# EasyEDA Pro project ProPrj_PCB_PCB_PCB_PCB_STM32F103C8T6(gift)_2023-09-09_2023-10-22_2024-01-15_2025-05-12.epro, board PCB5
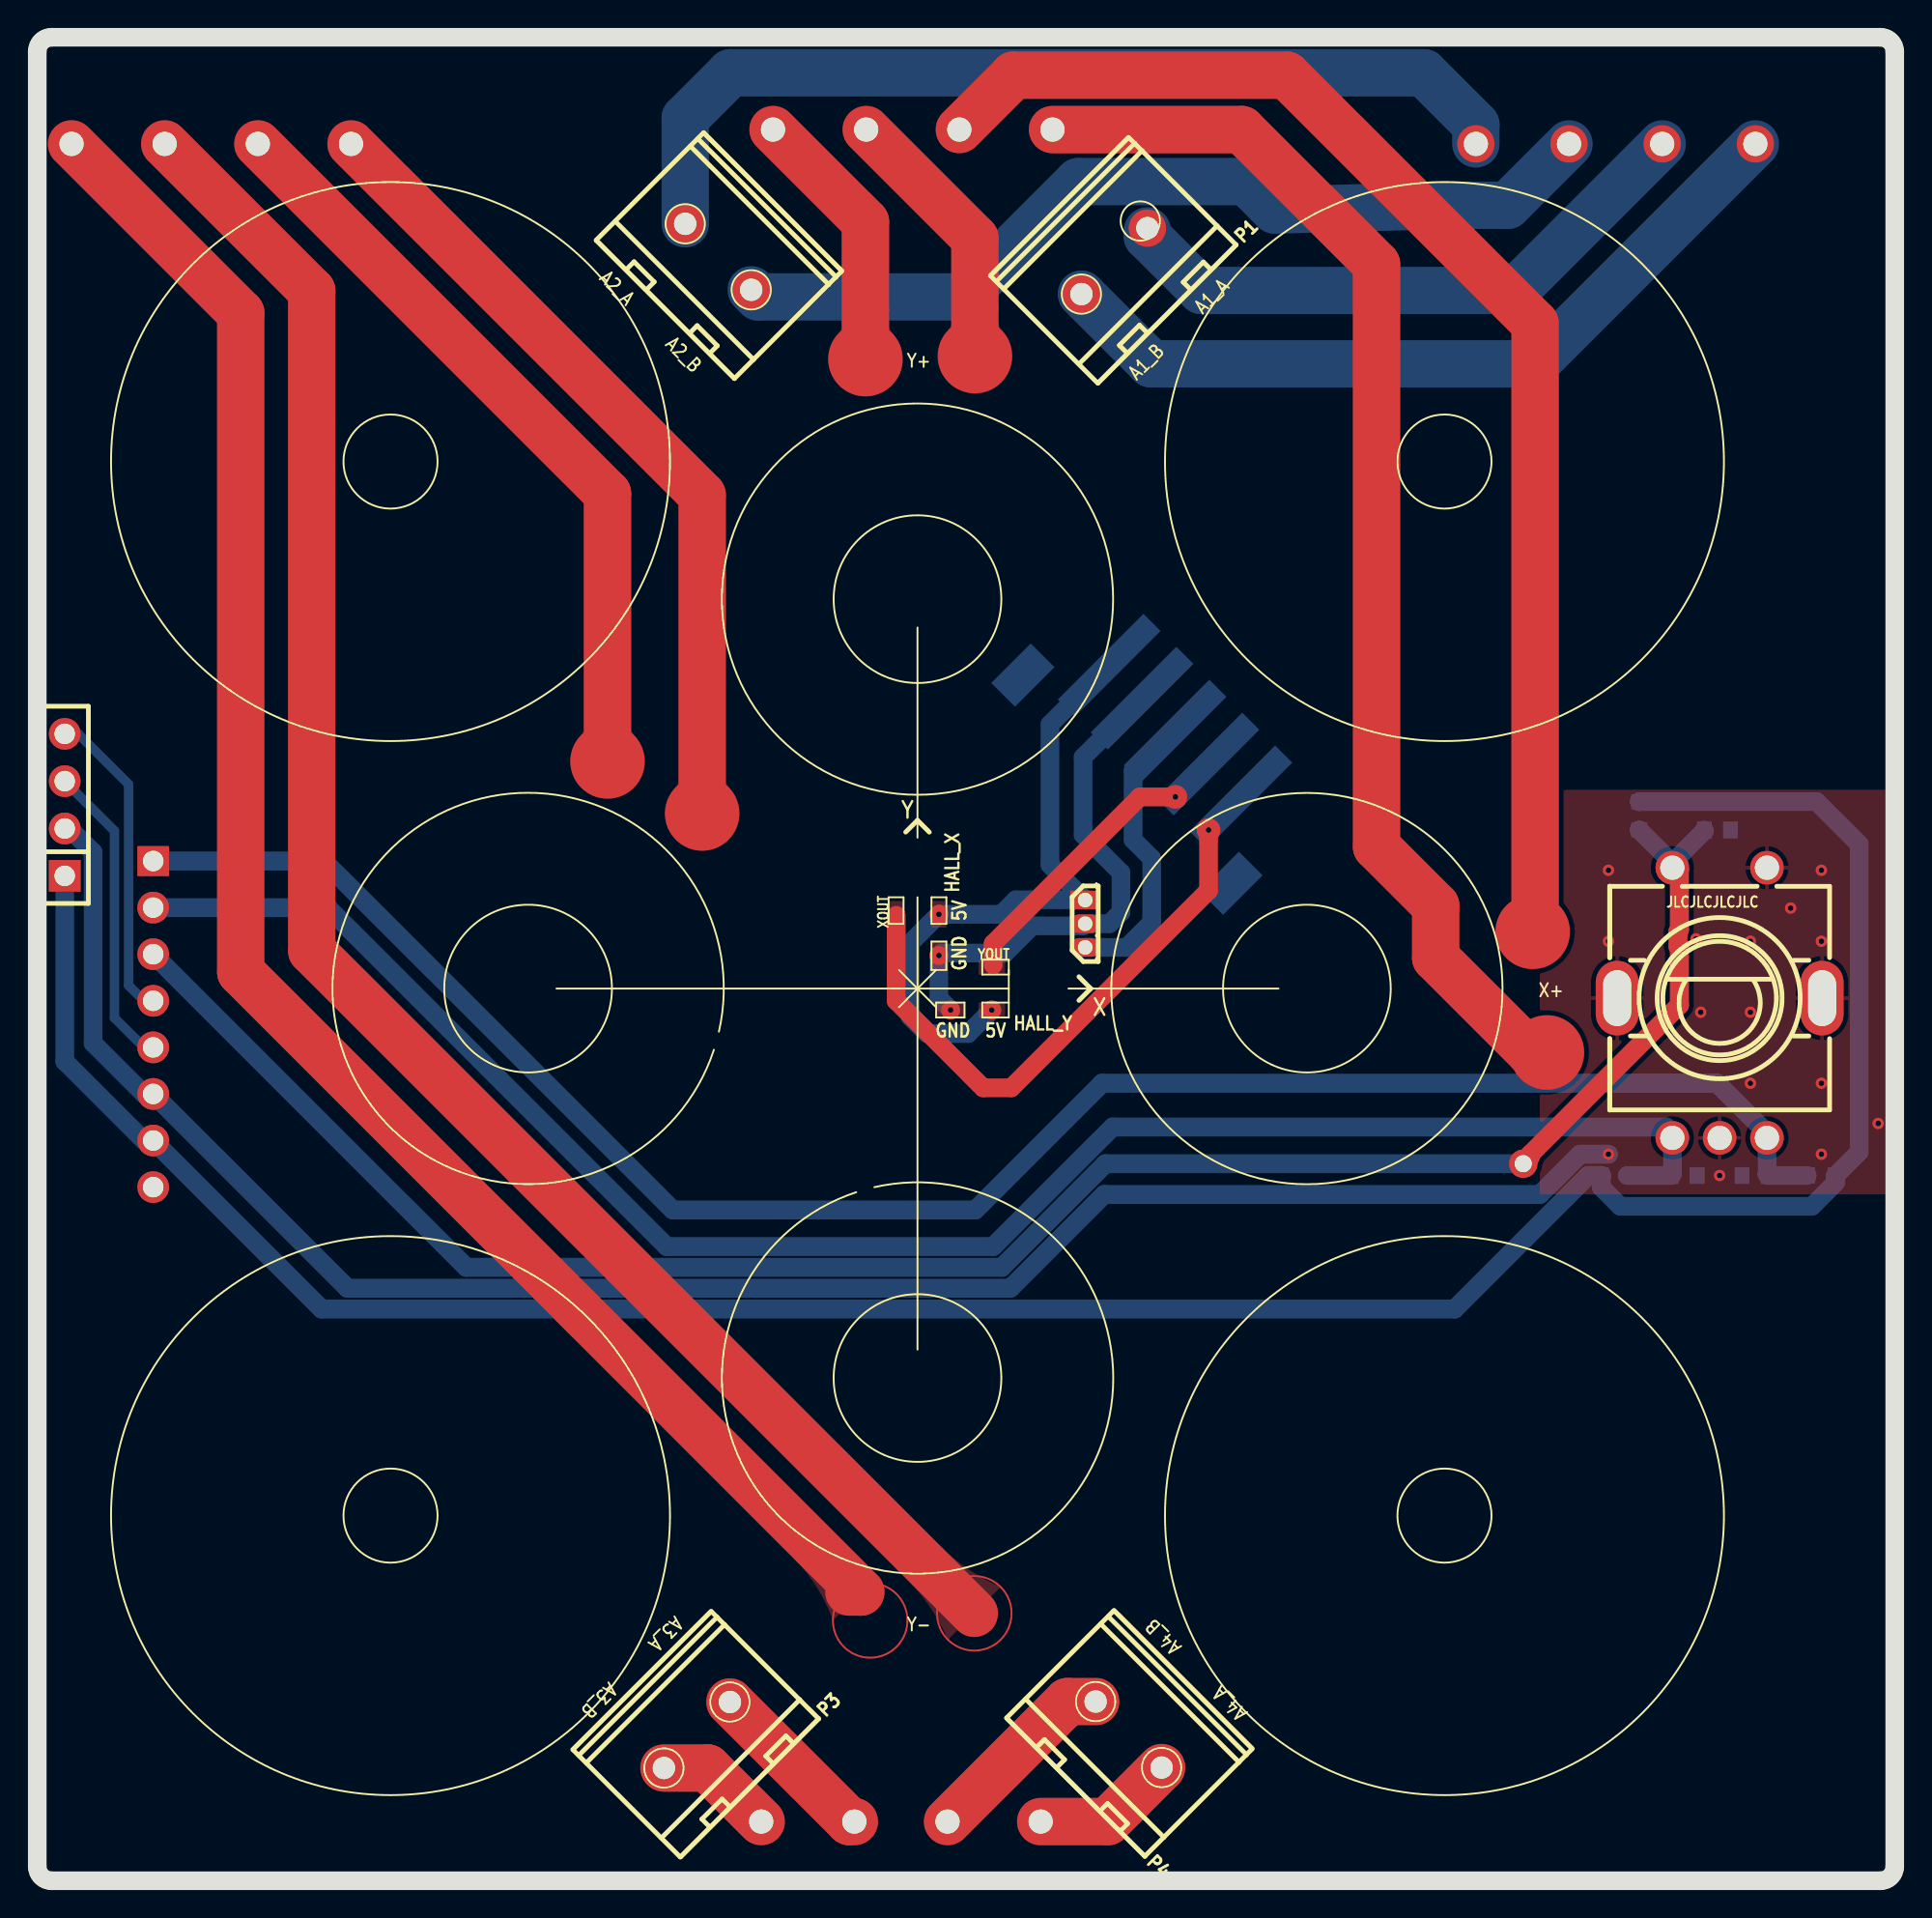
[diagram p6: board, top side]
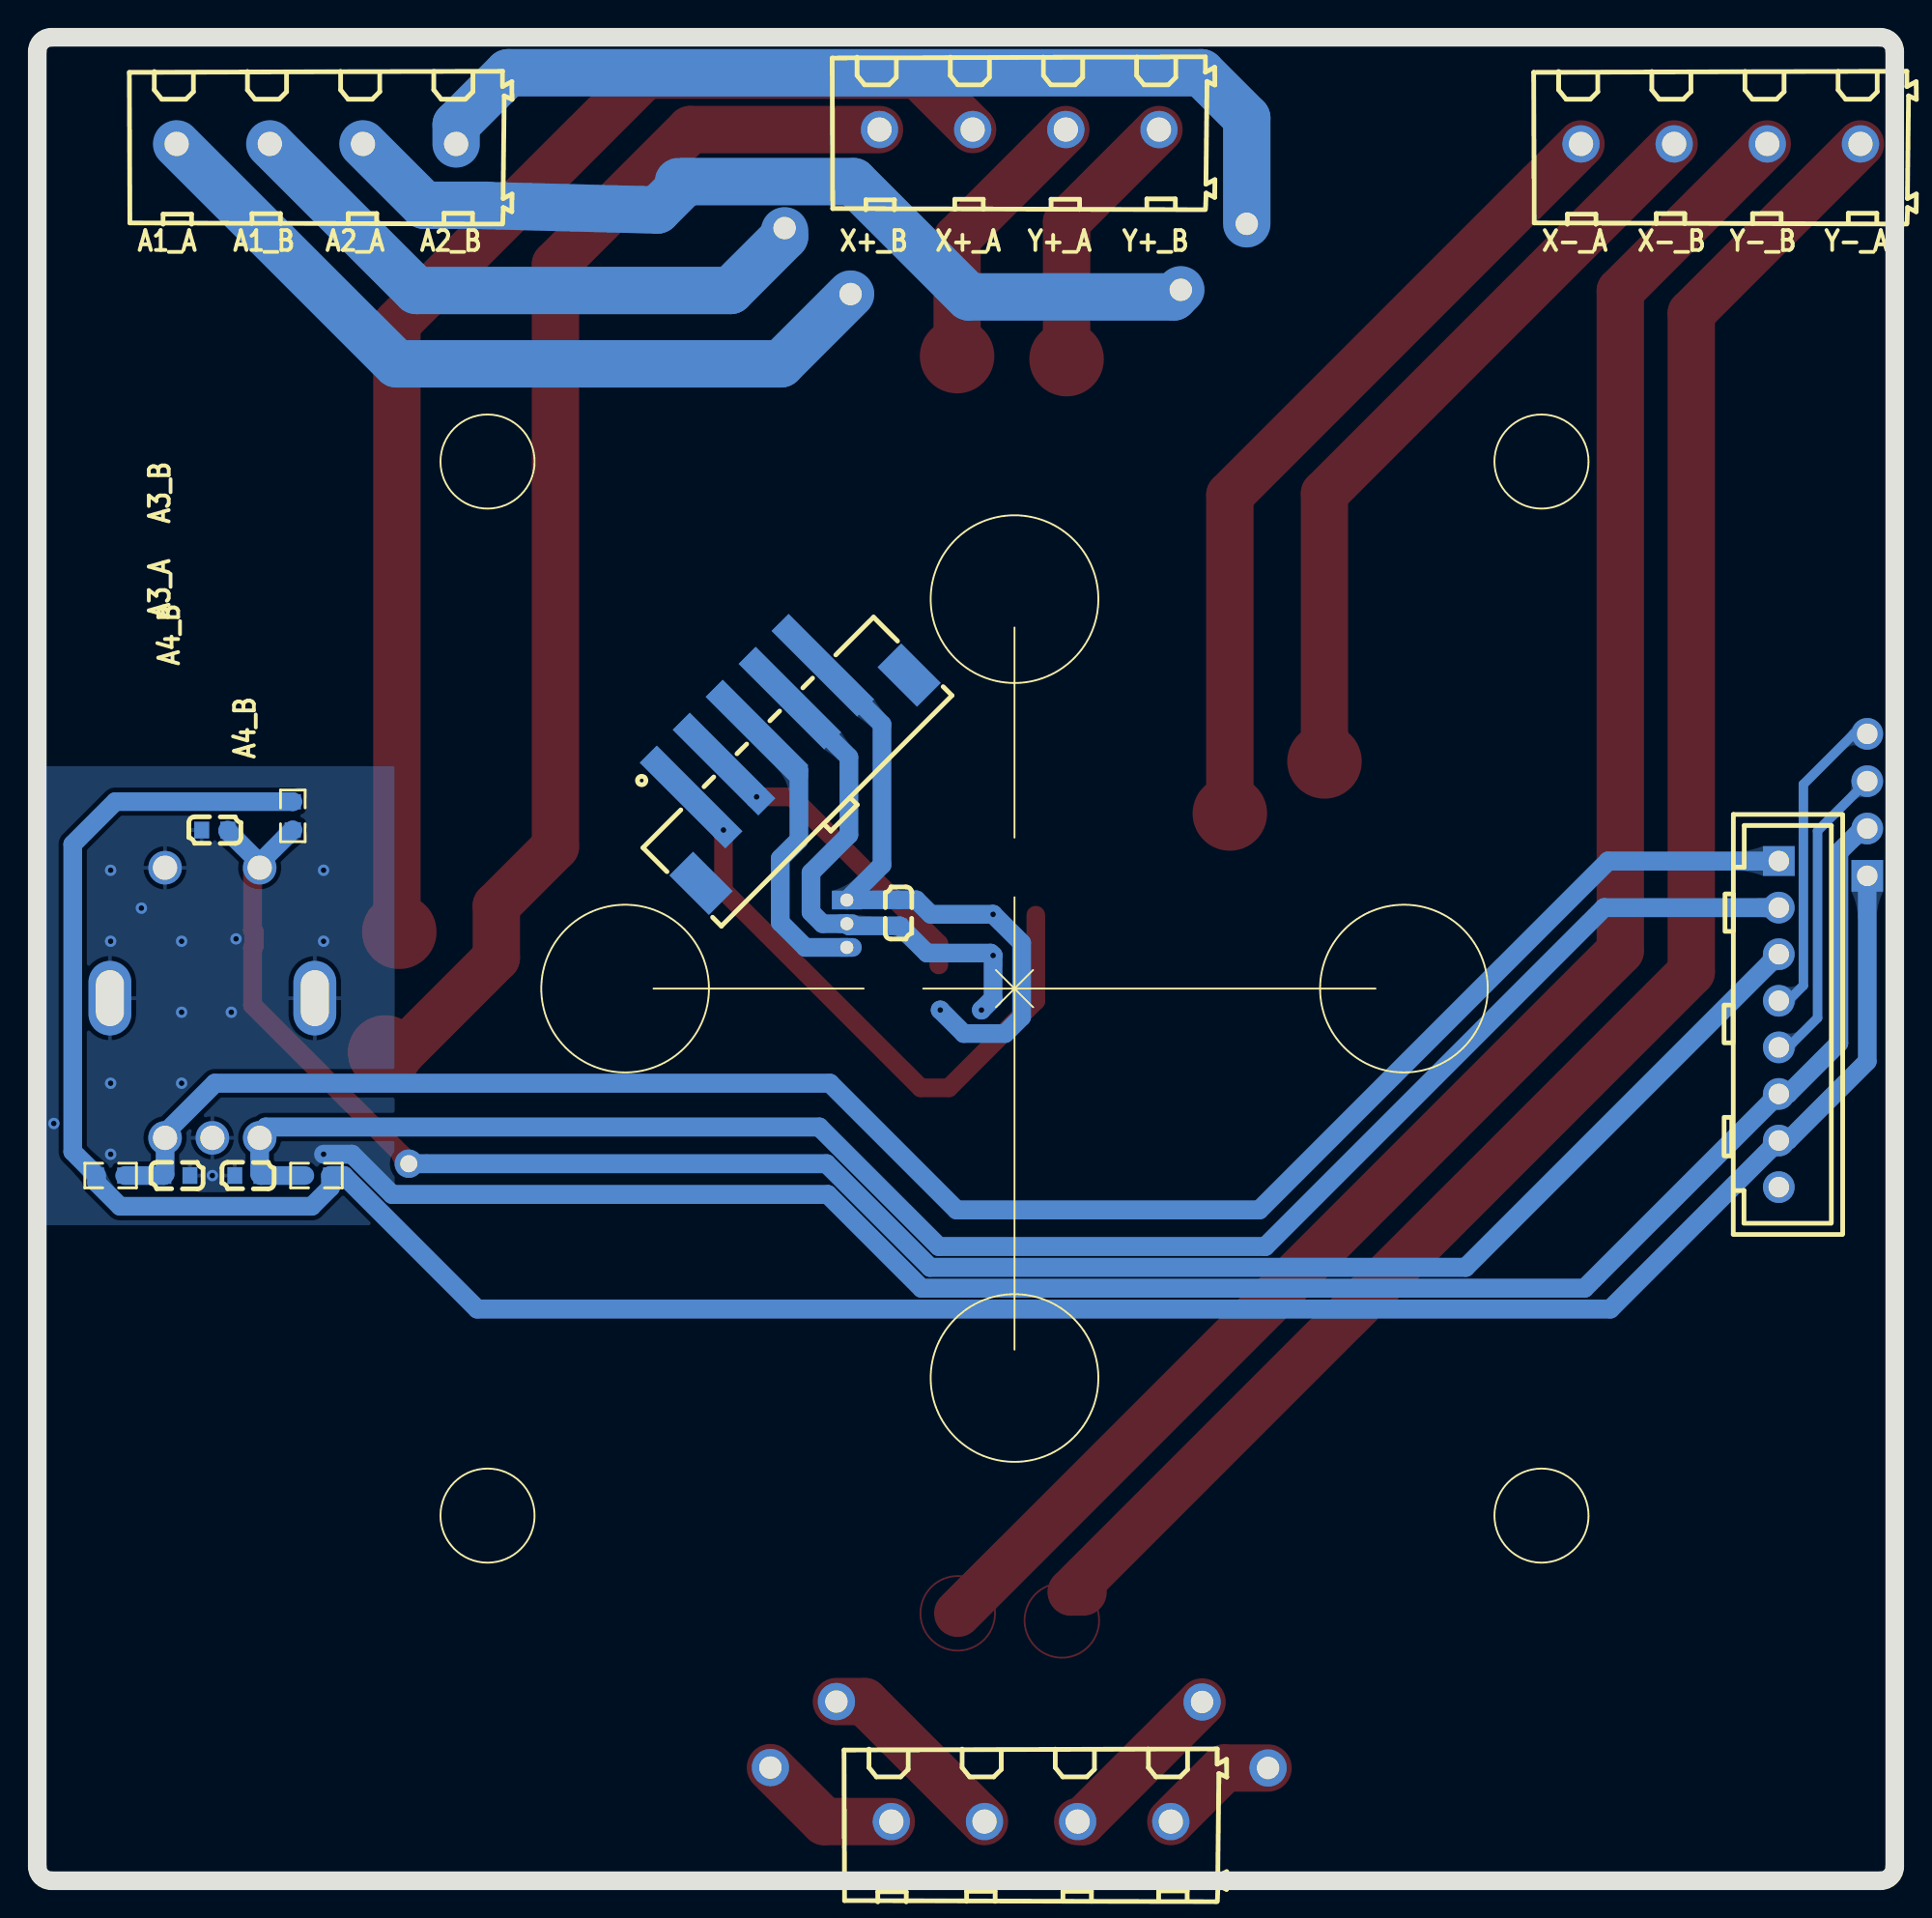
[diagram p7: board, bottom side, seen from below]

Outline 99.69 x 98.93 mm; copper layers: Top Layer, Bottom Layer. Coordinates in mm from the lower left corner of the outline.
Outline path: 0,98.17 0,0.76 arc(0.22,0.22) 0.76,0 98.93,0 arc(99.47,0.22) 99.69,0.76 99.69,98.17 arc(99.47,98.71) 98.93,98.93 0.76,98.93 arc(0.22,98.71) 0,98.17
Stack: Top Layer 0.035mm / Dielectric1 1.51mm FR4 er 4.5 / Bottom Layer 0.035mm

## Design rules (mm)
template: JLCPCB Capability(Two Layers Board)
spacing copperThickness1oz (default): track to track 0.102, other pairs 0.152 to 0.3
spacing copperThickness2oz: track to track 0.203, other pairs 0.152 to 0.3
track width copperThickness1oz (default): min 0.127, default 0.254, max 2.54
track width copperThickness2oz: min 0.203, default 0.254, max 2.54
differential pair differentialPair (default): width min 0.127, default 0.254, max 2.54; gap min 0.152, default 0.152
via viaSize (default): diameter min 0.5, default 0.61, max 10; hole min 0.3, default 0.305, max 6.3

## Placement (name value [footprint] x y rotation side)
C1  100nF  [C0603]  90.17 56.39 0 bottom
C2  100nF  [C0603]  88.39 37.85 0 bottom
C3  100nF  [C0603]  92.2 37.85 0 bottom
C5  0.1uF  [C0603]  53.47 51.94 90 bottom
CN1  -_AXIS  [CONN-TH_4P-P5.00_WJ127-5.0-4P]  9.34 93.21 0 bottom
CN2  +_AXIS  [CONN-TH_4P-P5.00_WJ127-5.0-4P]  46.99 93.98 0 bottom
CN3  ALT_1_2  [CONN-TH_4P-P5.00_WJ127-5.0-4P]  84.71 93.21 0 bottom
CN4  UI  [CONN-TH_8P-P2.50_HCTL_HC-XHB-8A]  6.22 45.97 270 bottom
CN5  ALT_3_4  [CONN-TH_4P-P5.00_WJ127-5.0-4P]  46.35 3.17 0 bottom
NOREF  -  [Pad_e556]  35.69 57.28 0 top
NOREF#2  -  [Pad_e559]  44.7 13.97 0 top
NOREF#3  -  [Pad_e560]  50.29 14.35 0 top
NOREF#4  -  [Pad_e530]  44.45 81.66 0 top
NOREF#5  -  [Pad_e251]  79.76 38.48 0 top
NOREF#6  -  [Pad_e555]  30.61 60.07 0 top
NOREF#7  -  [Pad_e558]  80.26 50.93 0 top
NOREF#8  -  [Pad_e557]  81.03 44.45 0 top
NOREF#9  -  [Pad_e531]  50.33 81.82 0 top
P1  WJ127-5.0-2P  [CONN-TH_2P-P5.00_CPC3703CTR]  57.81 86.92 225 top
P2  WJ127-5.0-2P  [CONN-TH_2P-P5.00_CPC3703CTR]  36.55 87.15 135 top
P3  WJ127-5.0-2P  [CONN-TH_2P-P5.00_CPC3703CTR]  35.41 7.82 225 top
P4  WJ127-5.0-2P  [CONN-TH_2P-P5.00_CPC3703CTR]  58.57 7.84 135 top
R1  10K  [R0603]  85.98 57.15 270 bottom
R2  10K  [R0603]  84.71 37.85 0 bottom
R3  10K  [R0603]  95.76 37.85 0 bottom
SW1  -  [SW-TH_EC11XXXXXXXX]  90.3 47.12 0 top
U1  HALL_OUT  [CONN-SMD_5P-P2.50_SHOU_2.54-5PLTDK]  59.78 60.41 135 bottom
U2  OLED  [HDR-TH_4P-P2.54-V-F]  1.47 57.74 90 top
U3  HALL_Z  [TO-92S_L4.0-W1.52-P1.27-R]  56.24 51.36 90 top

## Footprints (pads in the part's own frame, mm; a bottom-side part is the same pattern mirrored in y, then rotated)
C0603
  rect 0.8x0.9 smd: 1(-0.7,0) 2(0.7,0)
CONN-SMD_5P-P2.50_SHOU_2.54-5PLTDK
  rect 1.3x6.5 smd: 1(-5,1.825) 2(-2.5,1.825) 3(0,1.825) 4(2.5,1.825) 5(5,1.825)
  rect 1.8x3 smd: 6(7.9,-1.825) 7(-7.9,-1.825)
CONN-TH_2P-P5.00_CPC3703CTR
  round 2 hole 1.2: 1(-2.505,0) 2(2.505,0)
CONN-TH_4P-P5.00_WJ127-5.0-4P
  round 2 hole 1.3: 1(-7.5,0) 2(-2.5,0) 3(2.5,0) 4(7.5,0)
CONN-TH_8P-P2.50_HCTL_HC-XHB-8A
  rect 1.6x1.7 hole 1.1: 1(-8.75,0)
  round 1.7 hole 1.1: 2(-6.25,0) 3(-3.75,0) 4(-1.25,0) 5(1.25,0) 6(3.75,0) 7(6.25,0) 8(8.75,0)
HDR-TH_4P-P2.54-V-F
  rect 1.7x1.7 hole 1.1: 1(-3.81,0)
  round 1.7 hole 1.1: 2(-1.27,0) 3(1.27,0) 4(3.81,0)
Pad_e251
  round 1.524 hole 0.914: 1(0,0)
Pad_e530
  round 4 smd: 9(0,0)
Pad_e531
  round 4 smd: 10(0,0)
Pad_e555
  round 4 smd: 11(0,0)
Pad_e556
  round 4 smd: 12(0,0)
Pad_e557
  round 4 smd: 13(0,0)
Pad_e558
  round 4 smd: 14(0,0)
Pad_e559
  custom 4x4 smd: 15(0,0)
Pad_e560
  custom 4x4 smd: 16(0,0)
R0603
  rect 0.806x0.864 smd: 1(-0.753,0) 2(0.753,0)
SW-TH_EC11XXXXXXXX
  oval 2.301x4 hole 1.501x2.999: 6(5.499,0.249) 7(-5.499,0.249)
  round 1.801 hole 1.3: A(-2.54,-7.249) B(2.54,-7.249) C(0,-7.249) D(-2.54,7.249) E(2.54,7.249)
TO-92S_L4.0-W1.52-P1.27-R
  rect 1x1.6 hole 0.7: 1(1.27,0)
  oval 1x1.6 hole 0.7: 2(0,0) 3(-1.27,0)

## Nets
3V3: CN4.7 R1.1 R2.1 R3.2 U2.1
+5V: CN4.8
AGND: C5.1 U1.4 U3.2
GND: C1.2 C2.2 C3.1 CN4.6 SW1.6 SW1.7 SW1.C SW1.E U2.2
A+5V: C5.2 U1.5 U3.1
ALT_1_A: CN3.4 P1.2
ALT_1_B: CN3.3 P1.1
ALT_2_A: CN3.2 P2.1
ALT_2_B: CN3.1 P2.2
ALT_3_A: CN5.2 P3.1
ALT_3_B: CN5.1 P3.2
ALT_4_A: CN5.4 P4.1
ALT_4_B: CN5.3 P4.2
ENC_A: C2.1 CN4.2 R2.2 SW1.A
ENC_B: C3.2 CN4.1 R3.1 SW1.B
ENC_KEY: C1.1 CN4.3 NOREF#5.1 R1.2 SW1.D
HALL_X_OUT: U1.1
HALL_Y_OUT: U1.2
HALL_Z_OUT: U1.3 U3.3
OLED_SCL: CN4.5 U2.3
OLED_SDA: CN4.4 U2.4
X+_A: CN2.3 NOREF#7.14
X+_B: CN2.4 NOREF#8.13
X-_A: CN1.4 NOREF.12
X-_B: CN1.3 NOREF#6.11
Y+_A: CN2.2 NOREF#9.10
Y+_B: CN2.1 NOREF#4.9
Y-_A: CN1.1 NOREF#2.15
Y-_B: CN1.2 NOREF#3.16

Pads without a net: U1 6 7

## Via types
v1: diameter 1.27, hole 0.305, Top Layer to Bottom Layer, 2 vias
v2: diameter 1.016, hole 0.305, Top Layer to Bottom Layer, 4 vias
v3: diameter 0.61, hole 0.305, Top Layer to Bottom Layer, 15 vias

## Routing (per net, layer and track width the routed paths; a pad name or vN(x,y) marks a point on that pad's centre or on a via; arc(x,y) is an arc through that point)
3V3: length 146.5
  Bottom Layer w1: R1.1 85.99,57.91 95.5,57.91 97.79,55.63 97.79,39.12 R3.2 96.51,37.46 95.25,36.19 84.96,36.19 83.96,37.2 R2.1 ; CN4.7 5.72,39.72 1.47,43.97 U2.1
  Bottom Layer w1.016: R2.1 83.24,37.85 76.08,30.68 15.27,30.68 CN4.7
AGND: length 27.6
  Bottom Layer w1: U1.4 56.13,60.3 56.13,56.13 58.17,54.1 58.17,51.98 57.54,51.36 U3.2 56.13,51.24 C5.1 53.4,51.24 51.94,49.78 48.52,49.78 v2(48.39,49.65) 48.39,47.35 v2(49.02,46.73)
GND: length 102.1
  Bottom Layer w1: CN4.6 5.72,42.22 3,44.95 3,55.2 1.73,56.47 U2.2
  Bottom Layer w1.016: CN4.6 16.65,31.8 52.23,31.8 57.26,36.83 80.65,36.83 82.8,38.99 v3(84.33,38.99)
  vias: v3(84.33,54.23) v3(84.33,50.42) v3(89.03,50.55) v3(89.28,46.61) v3(90.3,37.85) v3(91.95,50.42) v3(91.95,46.61) v3(91.95,42.8) v3(94.11,52.2) v3(95.76,54.23) v3(95.76,50.42) v3(95.76,42.8) v3(95.76,38.99) v3(98.81,40.64)
A+5V: length 34.3
  Bottom Layer w1: U1.5 54.36,62.06 54.36,54.52 56.23,52.64 ; 56.23,52.64 C5.2 52.52,52.64 51.74,51.86 v2(48.39,51.86) 46.86,50.33 46.86,46.35 47.75,45.47 49.97,45.47 v2(51.23,46.73) ; 56.23,52.64 U3.1
ALT_1_A: length 42.6
  Bottom Layer w2.54: CN3.4 80.41,81.41 59.78,81.41 56.04,85.15
ALT_1_B: length 32.4
  Bottom Layer w2.54: 59.58,88.54 59.58,88.24 62.48,85.34 79.35,85.34 CN3.3
ALT_2_A: length 49.2
  Bottom Layer w2.54: P2.1 38.7,85 49.7,85 55.88,91.19 65.28,91.19 ; 76.2,89.92 66.42,89.66 65.28,90.8 ; 76.2,89.92 75.5,89.92 ; 76.2,89.92 78.92,89.92 CN3.2
ALT_2_B: length 51.3
  Bottom Layer w2.54: CN3.1 77.21,94.24 74.42,97.03 37.21,97.03 34.78,94.59 P2.2
ALT_3_A: length 9.3
  Top Layer w2.54: 37.18,9.59 43.59,3.17 CN5.2
ALT_3_B: length 6.4
  Top Layer w2.54: CN5.1 35.98,6.05 P3.2
ALT_4_A: length 7.7
  Top Layer w2.54: P4.1 57.45,3.17 CN5.4
ALT_4_B: length 10.6
  Top Layer w2.54: P4.2 55.3,9.62 CN5.3
ENC_A: length 96.5
  Bottom Layer w1: 85.34,37.85 C2.1 87.76,37.91 87.76,40.12
  Bottom Layer w1.016: CN4.2 15.59,52.22 33.78,34.04 51.31,34.04 57.72,40.45 87.43,40.45 87.76,40.12
ENC_B: length 102.7
  Bottom Layer w1: 92.84,40.12 92.84,37.91 C3.2 R3.1
  Bottom Layer w1.016: 92.84,40.12 90.16,42.8 57.15,42.8 50.35,36 34.1,36 15.38,54.72 CN4.1
ENC_KEY: length 107.6
  Top Layer w1.016: 87.76,54.62 88.14,54.24 88.14,51.02 88.06,50.95 88.06,50.15 88.14,50.07 88.14,46.99 80.14,38.99 80.14,38.86 NOREF#5.1
  Bottom Layer w1: 85.97,56.39 85.99,56.39 87.76,54.62 89.47,56.33 C1.1
  Bottom Layer w1.016: CN4.3 23.03,32.92 51.77,32.92 57.33,38.48 NOREF#5.1
HALL_X_OUT: length 30.9
  Top Layer w1: 46.1,51.82 46.1,47.22 50.77,42.55 52.28,42.55 62.87,53.14 v1(62.87,56.39)
HALL_Y_OUT: length 14.2
  Top Layer w1: 51.31,49.15 51.31,50.29 59.18,58.17 v1(61.09,58.17)
HALL_Z_OUT: length 15.8
  Bottom Layer w1: U1.3 60.94,61.7 58.82,59.58 58.82,55.86 59.82,54.86 59.82,51.43 58.47,50.09 U3.3
OLED_SCL: length 16.5
  Bottom Layer w0.508: CN4.5 5.72,44.72 4.14,46.31 4.14,56.34 U2.3
OLED_SDA: length 17
  Bottom Layer w0.508: U2.4 2.19,61.55 4.9,58.84 4.9,48.05 5.72,47.22 CN4.4
X+_A: length 70.3
  Top Layer w2.54: NOREF#7.14 80.39,51.05 80.39,83.57 67.06,96.9 52.41,96.9 CN2.3
X+_B: length 67
  Top Layer w2.54: CN2.4 64.64,93.98 71.88,86.74 71.88,55.5 75.06,52.32 75.06,49.53 80.14,44.45 NOREF#8.13
X-_A: length 43.7
  Top Layer w2.54: NOREF.12 35.69,74.36 CN1.4
X-_B: length 40.9
  Top Layer w2.54: CN1.3 30.61,74.44 NOREF#6.11
Y+_A: length 14.6
  Top Layer w2.54: NOREF#9.10 50.33,88.14 CN2.2
Y+_B: length 14.4
  Top Layer w2.54: NOREF#4.9 44.45,89.02 CN2.1
Y-_A: length 95.9
  Top Layer w2.54: 43.56,15.49 44.2,15.49 10.92,48.77 10.92,84.13 CN1.1
Y-_B: length 96.9
  Top Layer w2.54: NOREF#3.16 14.73,49.91 14.73,85.32 CN1.2

## Copper pours and planes (outline as drawn; the poured copper is in the pictures)
AGND on Top Layer: 48.24,47.13 49.79,47.13 49.79,46.33 48.24,46.33
AGND on Top Layer: 47.99,50.43 48.79,50.43 48.79,48.88 47.99,48.88
GND on Top Layer: 80.65,58.55 99.95,58.55 99.95,36.83 80.65,36.83
GND on Bottom Layer: 80.52,59.82 100.71,59.82 100.71,35.18 80.52,35.18
A+5V on Top Layer: 50.52,47.13 51.94,47.13 51.94,46.33 50.52,46.33
A+5V on Top Layer: 47.99,52.58 48.79,52.58 48.79,51.15 47.99,51.15
HALL_X_OUT on Top Layer: 45.69,52.58 46.49,52.58 46.49,51.15 45.69,51.15
HALL_Y_OUT on Top Layer: 50.52,49.43 51.94,49.43 51.94,48.63 50.52,48.63

Small or netless copper shapes (teardrops, artwork), in the pictures only: 8 on Top Layer, 31 on Bottom Layer

## Text on the board
Bottom Silkscreen Layer: A4_B | A3_B | A3_A | Y-_A | Y-_B | X-_B | X-_A | Y+_B | Y+_A | X+_A | X+_B | A2_B | A2_A | A1_B | A1_A
Top Silkscreen Layer: YOUT | XOUT | JLCJLCJLCJLC | Y+ | Y- | X+ | A1_B | A1_A | A2_A | A2_B | A4_B | A4_A | A3_B | A3_A | GND | 5V | HALL_Y | HALL_X | Y | X
